# EAGLE design antenna (EAGLE 9.6.2)
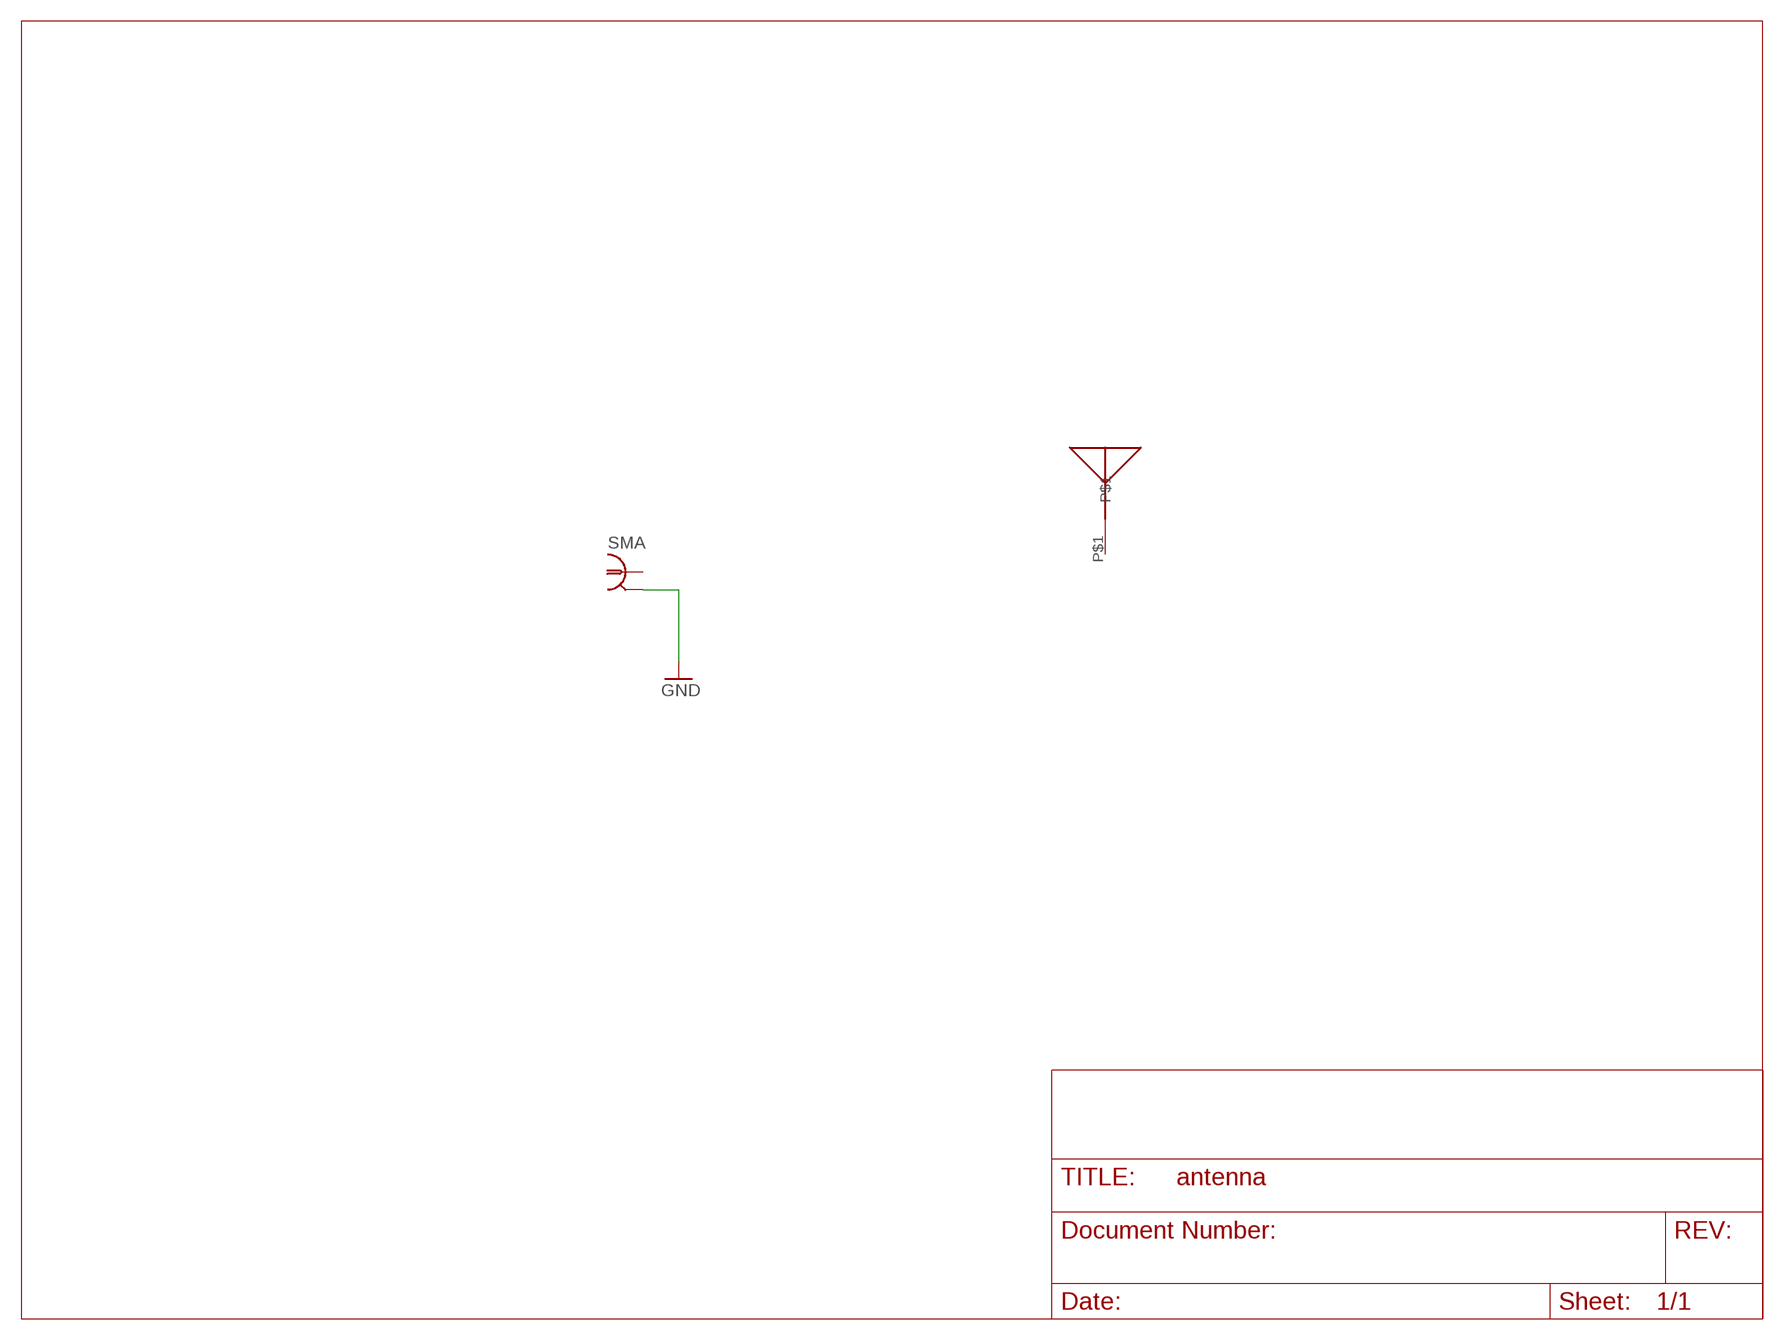
[diagram p0: schematic, sheet 1]

## Parts
ANTENNA  0433AT62A0020  [0433AT62A0020]
SMA  LTI-SASF54GT  [LTI-SASF54GT]

## Nets
GND: SMA.2 SMA.3 SMA.4 SMA.5
Unconnected: ANTENNA.P$1 SMA.1

## Library data of the parts
ANTENNA = antenna:0433AT62A0020
SMA = con-coax:LTI-SASF54GT: SMA vertical PCB thrue hole jack Source: Lighthorse Technologies, inc. SASF54GT.pdf; OC_FARNELL: unknown; OC_NEWARK: unknown

## Board
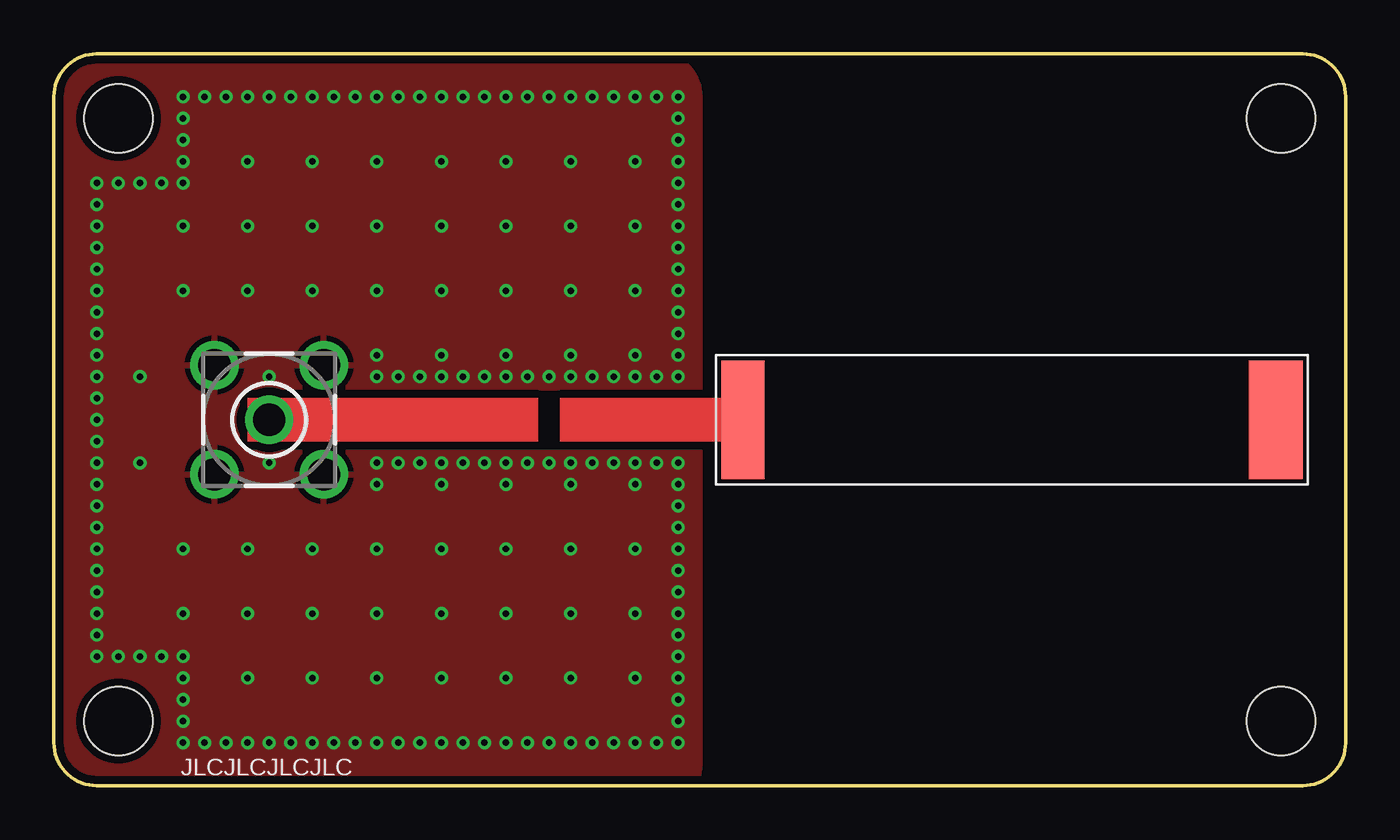
[diagram p1: board, top side]
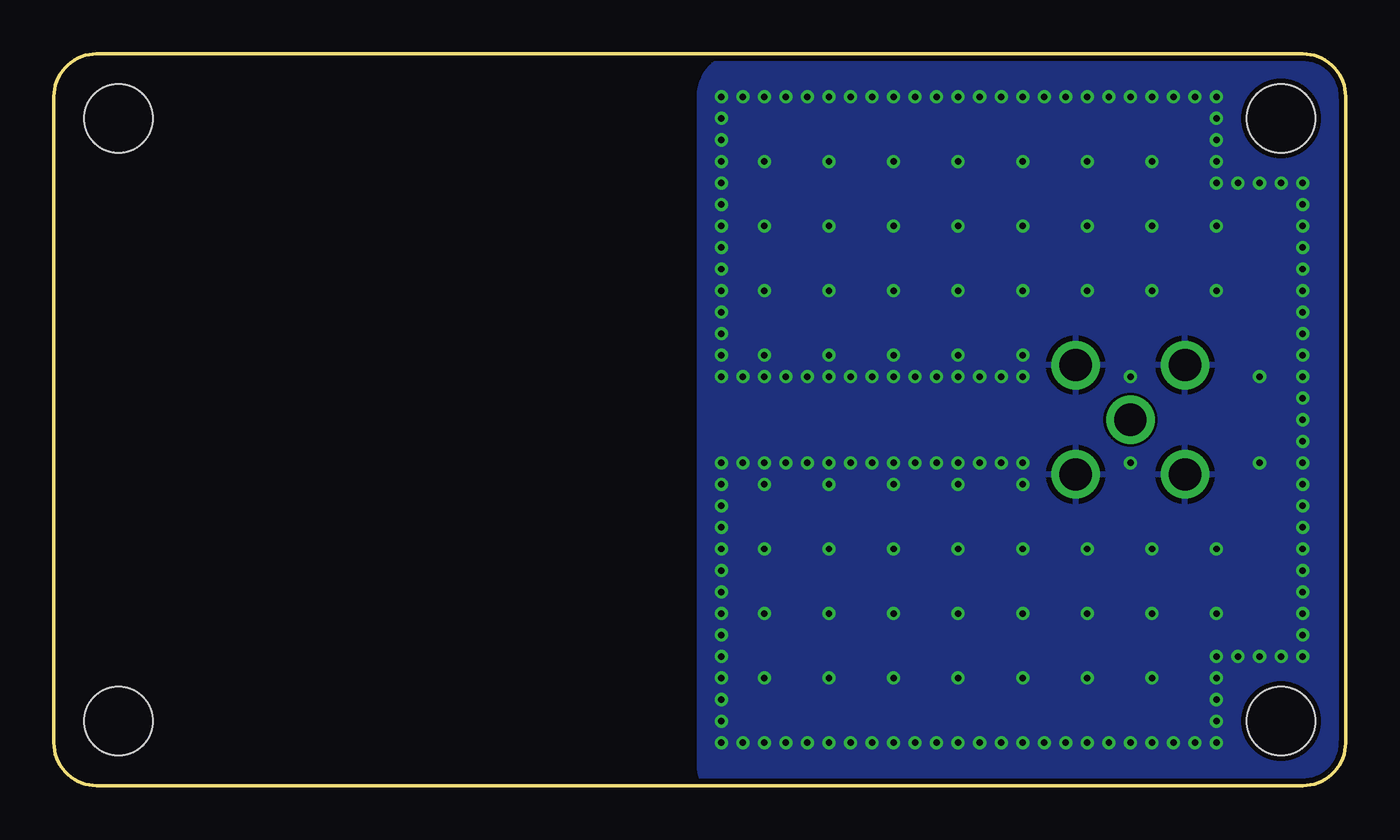
[diagram p2: board, bottom side, seen from below]

Size 60 x 34 mm. Coordinates in mm from the lower left corner, seen from the top.
Outline: 2,0 58,0 arc90 60,2 60,32 arc90 58,34 2,34 arc90 0,32 0,2 arc90 2,0
Copper layers (1*16): Top 0.035mm / dielectric 1.5mm / Bottom 0.035mm
Design rules "JLCPCB": minimum track width 3.5mil, minimum drill 0.2mm, track to track 5mil, track to pad 5mil, pad to pad 5mil, via to via 5mil, smd to smd 0mil, copper to edge 10mil, drill to drill 10mil, minimum pad ring 3mil, minimum via ring 6mil, stop-mask expansion 2mil, vias tented up to drill 25mil, thermal gap 10mil
Holes 3.17 mm at 3,31 3,3 57,31 57,3
tRestrict: 1 lines

### Footprints (pad centres in the part's own frame; a part is rotated, then mirrored left to right if it is on the bottom)
0433AT62A0020 = smd 2 x 5.5: P$1 0,0 | smd 2.5 x 5.5: P$2 24.75,0
LTI-SASF54GT = drill 1.5 pad 2.2: 1 0,0; 2 -2.54,2.54; 3 2.54,2.54; 4 2.54,-2.54; 5 -2.54,-2.54

### Placement (x,y rotation side)
ANTENNA  32,17 0 top
SMA  10,17 0 top

### Tracks (layer width: path | path; a pad name or v marks a point on that pad's centre or on a via)
GND  (via drill 0.3)
  other vias: 15,15 16,15 17,15 18,15 19,15 20,15 21,15 22,15 23,15 24,15 25,15 26,15 27,15 28,15 29,15 29,19 28,19 27,19 26,19 25,19 24,19 23,19 22,19 21,19 20,19 19,19 18,19 17,19 16,19 15,19 29,14 29,13 29,12 29,11 29,10 29,9 29,8 29,7 29,6 29,5 29,4 29,3 29,2 28,2 27,2 26,2 25,2 24,2 23,2 22,2 21,2 20,2 19,2 18,2 17,2 16,2 15,2 14,2 13,2 12,2 11,2 10,2 9,2 8,2 7,2 6,2 6,3 6,4 6,5 6,6 5,6 4,6 3,6 2,6 2,8 2,7 2,9 2,10 10,15 10,19 2,11 2,12 2,13 2,14 2,15 2,16 2,17 2,18 2,19 2,20 2,21 2,22 2,23 2,24 2,25 2,26 2,27 2,28 3,28 4,28 5,28 6,28 6,29 6,30 6,31 6,32 7,32 8,32 9,32 10,32 11,32 12,32 13,32 14,32 15,32 16,32 17,32 18,32 19,32 20,32 22,32 21,32 23,32 24,32 25,32 26,32 27,32 28,32 29,32 29,31 29,30 29,29 29,28 29,27 29,26 29,24 29,25 29,23 29,22 29,21 29,20 6,26 6,23 9,23 9,26 9,29 12,29 12,26 12,23 15,23 15,26 15,29 18,29 18,26 18,23 21,23 21,26 21,29 24,29 24,26 24,23 24,11 21,11 18,11 15,11 12,11 9,11 6,11 6,8 9,8 12,8 15,8 18,8 21,8 24,8 27,8 27,11 27,23 27,26 27,29 18,14 21,14 24,14 27,14 15,14 15,20 18,20 21,20 24,20 27,20 9,5 12,5 15,5 18,5 21,5 24,5 27,5 4,19 4,15
  pour Top (isolate 0.375): 0,32 0,1 arc90 2,-1 28,-1 arc90 30,1 30,32 arc90 28,34 2,34 arc90
  pour Bottom: 0,32 0,1 arc90 2,-1 28,-1 arc90 30,1 30,32 arc90 28,34 2,34 arc90
(copper drawn outside any net)
  shapes: Top area x2

### Text on the board
tNames: JLCJLCJLCJLC
214bmp: /Users/samueldewan/Downloads/carleton_wide_colour_1000.bmp